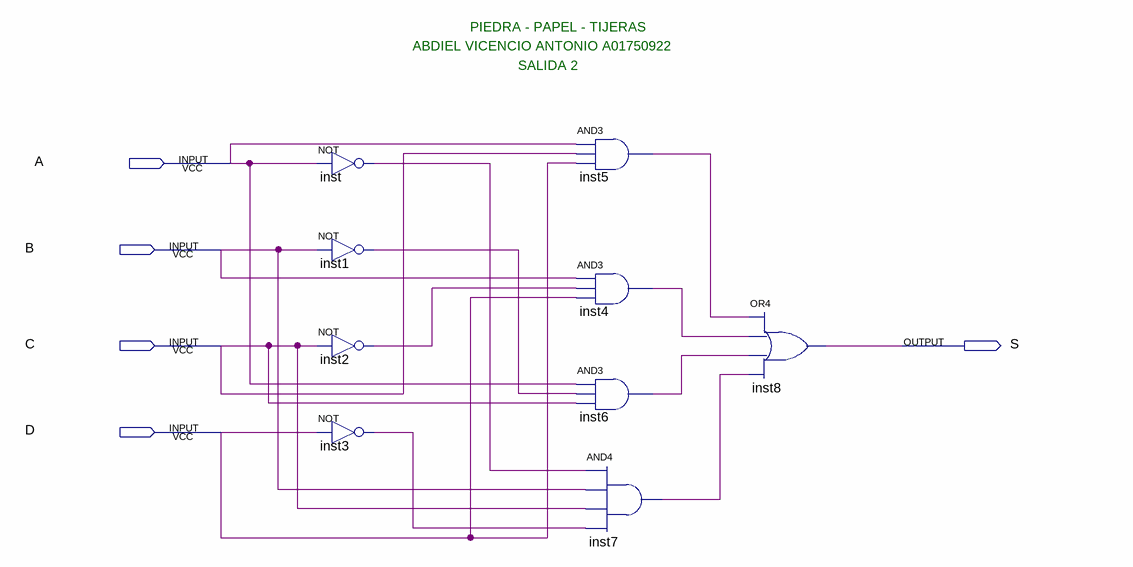
[diagram p0: schematic sheet]
// Quartus schematic PiedraPapelTijeras2.bdf as structural Verilog: 9 symbols, 5 pins
module PiedraPapelTijeras2 (
  input  A,
  input  B,
  input  C,
  input  D,
  output S
);

  wire inst1_out, inst2_out, inst3_out, inst4_out, inst5_out, inst6_out, inst7_out, inst_out;

  not inst (inst_out, A);
  not inst1 (inst1_out, B);
  not inst2 (inst2_out, C);
  not inst3 (inst3_out, D);
  and inst5 (inst5_out, A, C, D);
  and inst4 (inst4_out, B, inst2_out, D);
  and inst6 (inst6_out, A, inst1_out, C);
  and inst7 (inst7_out, inst_out, B, C, inst3_out);
  or inst8 (S, inst5_out, inst4_out, inst6_out, inst7_out);

  // Notes on the sheet:
  //   PIEDRA - PAPEL - TIJERAS
  //   ABDIEL VICENCIO ANTONIO A01750922
  //   SALIDA 2
endmodule
